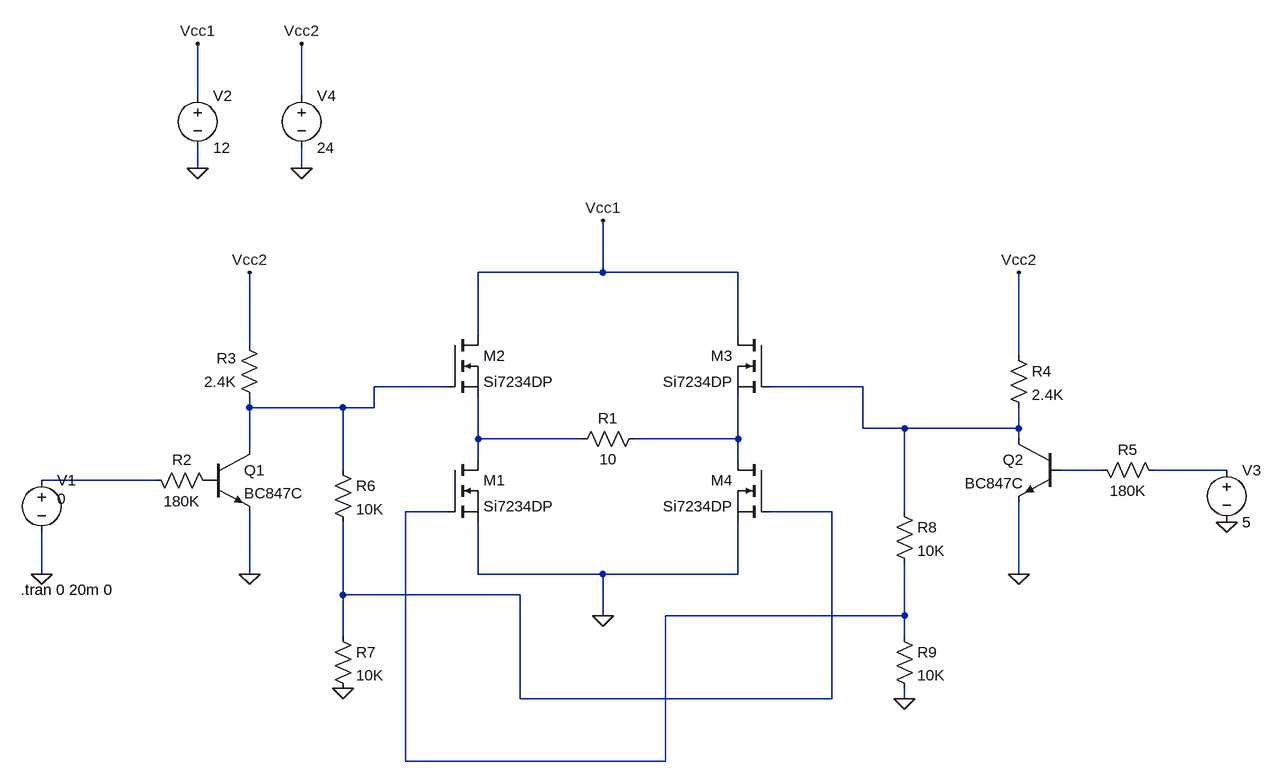
[diagram p0: schematic mostekH - NMOS .asc]
mostekH - NMOS .asc, the LTspice schematic file:
Version 4
SHEET 1 2096 680
WIRE 160 -496 160 -576
WIRE 320 -496 320 -576
WIRE 160 -384 160 -416
WIRE 320 -384 320 -416
WIRE 784 -224 784 -304
WIRE 784 -224 592 -224
WIRE 992 -224 784 -224
WIRE 592 -128 592 -224
WIRE 992 -128 992 -224
WIRE 240 -112 240 -224
WIRE 1424 -96 1424 -224
WIRE 544 -48 432 -48
WIRE 1184 -48 1040 -48
WIRE 240 -16 240 -32
WIRE 384 -16 240 -16
WIRE 432 -16 432 -48
WIRE 432 -16 384 -16
WIRE 1184 16 1184 -48
WIRE 1248 16 1184 16
WIRE 1424 16 1424 -16
WIRE 1424 16 1248 16
WIRE 592 32 592 -32
WIRE 752 32 592 32
WIRE 992 32 992 -32
WIRE 992 32 832 32
WIRE 1424 32 1424 16
WIRE 240 48 240 -16
WIRE 592 64 592 32
WIRE 992 64 992 32
WIRE 384 80 384 -16
WIRE 1552 80 1488 80
WIRE 1744 80 1632 80
WIRE 96 96 -80 96
WIRE 544 144 480 144
WIRE 1136 144 1040 144
WIRE 1248 144 1248 16
WIRE -80 240 -80 176
WIRE 240 240 240 144
WIRE 592 240 592 160
WIRE 784 240 592 240
WIRE 992 240 992 160
WIRE 992 240 784 240
WIRE 1424 240 1424 128
WIRE 384 272 384 160
WIRE 656 272 384 272
WIRE 784 304 784 240
WIRE 1248 304 1248 224
WIRE 1248 304 880 304
WIRE 384 336 384 272
WIRE 1248 336 1248 304
WIRE 656 432 656 272
WIRE 1136 432 1136 144
WIRE 1136 432 656 432
WIRE 1248 432 1248 416
WIRE 480 528 480 144
WIRE 880 528 880 304
WIRE 880 528 480 528
FLAG -80 240 0
FLAG 240 240 0
FLAG 784 304 0
FLAG 160 -384 0
FLAG 1424 240 0
FLAG 1744 160 0
FLAG 160 -576 Vcc1
FLAG 320 -384 0
FLAG 320 -576 Vcc2
FLAG 784 -304 Vcc1
FLAG 240 -224 Vcc2
FLAG 1424 -224 Vcc2
FLAG 384 416 0
FLAG 1248 432 0
DATAFLAG 880 32 ""
DATAFLAG 672 32 ""
DATAFLAG 592 176 ""
DATAFLAG 304 -16 ""
DATAFLAG 1296 16 ""
DATAFLAG 1024 304 ""
DATAFLAG 576 272 ""
SYMBOL voltage -80 80 R0
WINDOW 123 0 0 Left 0
WINDOW 39 0 0 Left 0
WINDOW 3 24 44 Left 2
SYMATTR InstName V1
SYMATTR Value 0
SYMBOL res 80 80 M90
WINDOW 0 0 56 VBottom 2
WINDOW 3 32 56 VTop 2
SYMATTR InstName R2
SYMATTR Value 180K
SYMBOL res 256 -16 R180
WINDOW 0 36 76 Left 2
WINDOW 3 36 40 Left 2
SYMATTR InstName R3
SYMATTR Value 2.4K
SYMBOL npn 176 48 R0
SYMATTR InstName Q1
SYMATTR Value BC847C
SYMBOL voltage 160 -512 R0
WINDOW 123 0 0 Left 0
WINDOW 39 0 0 Left 0
SYMATTR InstName V2
SYMATTR Value 12
SYMBOL voltage 1744 64 R0
WINDOW 123 0 0 Left 0
WINDOW 39 0 0 Left 0
SYMATTR InstName V3
SYMATTR Value 5
SYMBOL npn 1488 32 M0
SYMATTR InstName Q2
SYMATTR Value BC847C
SYMBOL res 1408 -112 R0
SYMATTR InstName R4
SYMATTR Value 2.4K
SYMBOL res 1536 64 M90
WINDOW 0 0 56 VBottom 2
WINDOW 3 32 56 VTop 2
SYMATTR InstName R5
SYMATTR Value 180K
SYMBOL res 848 16 R90
WINDOW 0 0 56 VBottom 2
WINDOW 3 32 56 VTop 2
SYMATTR InstName R1
SYMATTR Value 10
SYMBOL nmos 544 -128 R0
SYMATTR InstName M2
SYMATTR Value Si7234DP
SYMBOL nmos 1040 -128 M0
SYMATTR InstName M3
SYMATTR Value Si7234DP
SYMBOL nmos 544 64 R0
SYMATTR InstName M1
SYMATTR Value Si7234DP
SYMBOL nmos 1040 64 M0
SYMATTR InstName M4
SYMATTR Value Si7234DP
SYMBOL voltage 320 -512 R0
WINDOW 123 0 0 Left 0
WINDOW 39 0 0 Left 0
SYMATTR InstName V4
SYMATTR Value 24
SYMBOL res 368 64 R0
SYMATTR InstName R6
SYMATTR Value 10K
SYMBOL res 368 320 R0
SYMATTR InstName R7
SYMATTR Value 10K
SYMBOL res 1232 128 R0
SYMATTR InstName R8
SYMATTR Value 10K
SYMBOL res 1232 320 R0
SYMATTR InstName R9
SYMATTR Value 10K
TEXT -112 264 Left 2 !.tran 0 20m 0

The netlist it stands for:
* mostekH - NMOS .asc
V1 N007 0 0
R2 N007 P001 180K
R3 N001 Vcc2 2.4K
Q1 N001 P001 0 0 BC847C
V2 Vcc1 0 12
V3 N006 0 5
Q2 N002 N005 0 0 BC847C
R4 Vcc2 N002 2.4K
R5 N005 N006 180K
R1 N004 N003 10
M2 Vcc1 N001 N003 N003 Si7234DP
M3 Vcc1 N002 N004 N004 Si7234DP
M1 N003 N008 0 0 Si7234DP
M4 N004 N009 0 0 Si7234DP
V4 Vcc2 0 24
R6 N001 N009 10K
R7 N009 0 10K
R8 N002 N008 10K
R9 N008 0 10K
.model NPN NPN
.model PNP PNP
.lib standard.bjt
.model NMOS NMOS
.model PMOS PMOS
.lib standard.mos
.tran 0 20m 0
.backanno
.end